# EAGLE design Mikrobus-Cobbler (EAGLE 6.6.0)
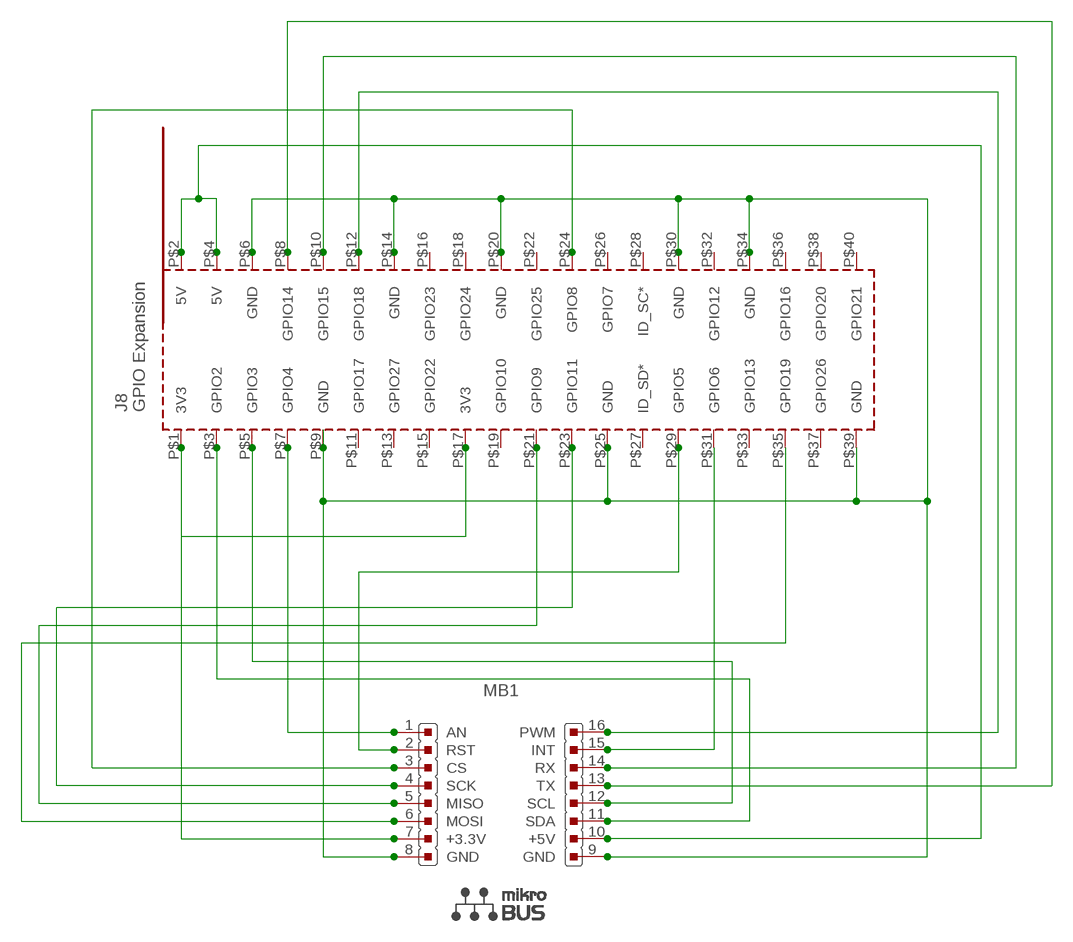
[diagram p0: schematic, sheet 1]

## Parts
MB1  MIKROBUSFOR-COBBLER  [MIKROBUS-COBBLER]
PCB1  RPI2-HEADER  [RPI2-HEADER]

## Nets
+3.3V: MB1.7(+3.3V) PCB1.P$1(3V3) PCB1.P$17(3V3)
+5V: MB1.10(+5V) PCB1.P$2(5V) PCB1.P$4(5V)
AN: MB1.1(AN) PCB1.P$7(GPIO4)
CS: MB1.3(CS) PCB1.P$24(GPIO8)
GND: MB1.8(GND) MB1.9(GND) PCB1.P$6(GND) PCB1.P$9(GND) PCB1.P$14(GND) PCB1.P$20(GND) PCB1.P$25(GND) PCB1.P$30(GND) PCB1.P$34(GND) PCB1.P$39(GND)
INT: MB1.15(INT) PCB1.P$31(GPIO6)
MISO: MB1.5(MISO) PCB1.P$21(GPIO9)
MOSI: MB1.6(MOSI) PCB1.P$35(GPIO19)
PWM: MB1.16(PWM) PCB1.P$12(GPIO18)
RST: MB1.2(RST) PCB1.P$29(GPIO5)
RX: MB1.14(RX) PCB1.P$10(GPIO15)
SCK: MB1.4(SCK) PCB1.P$23(GPIO11)
SCL: MB1.12(SCL) PCB1.P$5(GPIO3)
SDA: MB1.11(SDA) PCB1.P$3(GPIO2)
TX: MB1.13(TX) PCB1.P$8(GPIO14)
Unconnected: PCB1.P$11(GPIO17) PCB1.P$13(GPIO27) PCB1.P$15(GPIO22) PCB1.P$16(GPIO23) PCB1.P$18(GPIO24) PCB1.P$19(GPIO10) PCB1.P$22(GPIO25) PCB1.P$26(GPIO7) PCB1.P$27(ID_SD*) PCB1.P$28(ID_SC*) PCB1.P$32(GPIO12) PCB1.P$33(GPIO13) PCB1.P$36(GPIO16) PCB1.P$37(GPIO26) PCB1.P$38(GPIO20) PCB1.P$40(GPIO21)

## Library data of the parts
MB1 = KS Proto:MIKROBUS: MikroBUS Source: MikroBUS specification <http://www.mikroe.com/downloads/get/1737/mikrobus_specification.pdf> MikroBUS <http://www.mikroe.com/mikrobus/>
PCB1 = KS Proto:RPI2-HEADER: Device for Raspberry Pi 2 board created by www.element14.com More information and support community is available at http://www.element14.com/community/community/raspberry-pi/raspberrypi2

## Board
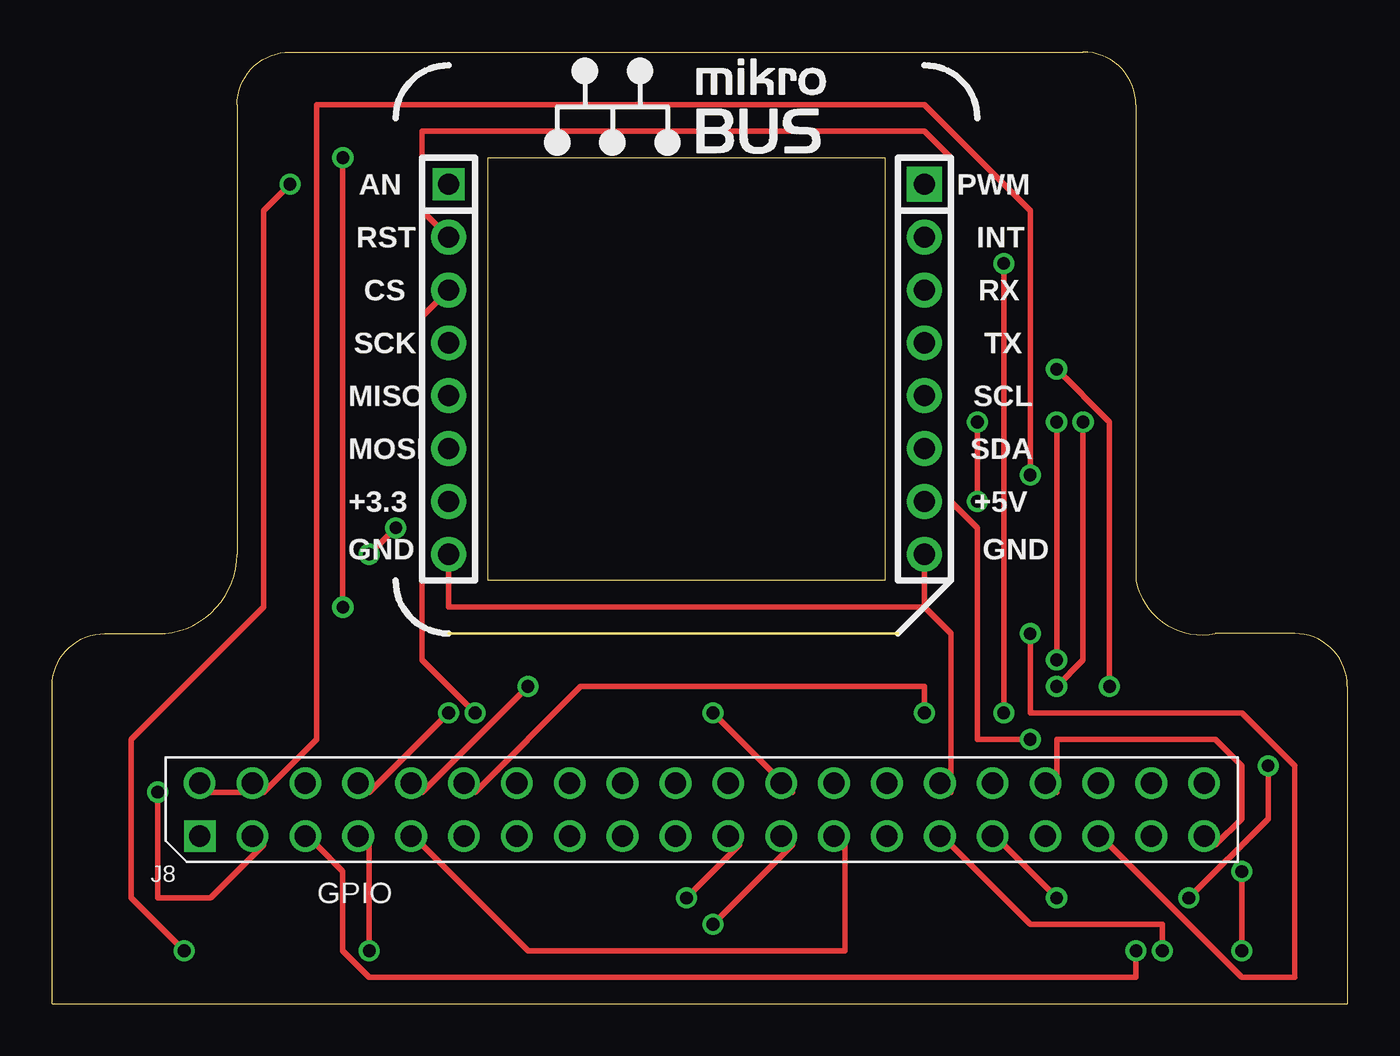
[diagram p1: board, top side]
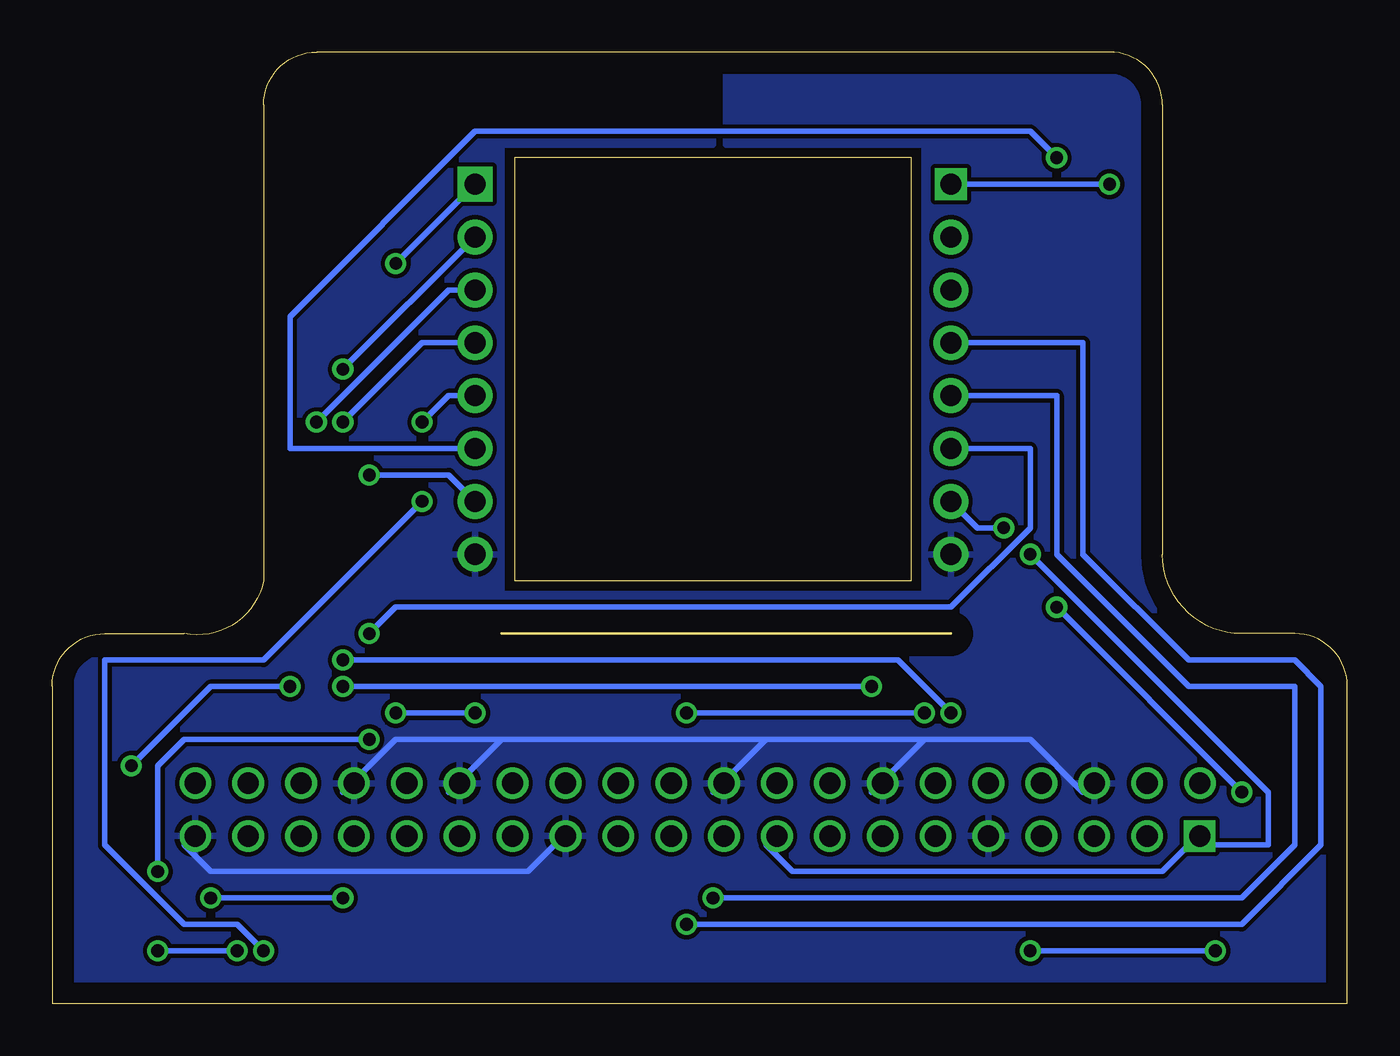
[diagram p2: board, bottom side, seen from below]

Size 62.23 x 45.72 mm. Coordinates in mm from the lower left corner, seen from the top.
Outline: 0,0 62.23,0 62.23,15.24 arc90 59.69,17.78 55.88,17.78 arc-90 52.07,20.32 52.07,43.18 arc90 49.53,45.72 11.43,45.72 arc90 8.89,43.18 8.89,21.59 arc-90 5.08,17.78 2.54,17.78 arc90 0,15.24 0,0
Copper layers (1*16): Top 0.035mm / dielectric 1.5mm / Bottom 0.035mm
Design rules "default": minimum track width 10mil, minimum drill 24mil, track to track 8mil, track to pad 8mil, pad to pad 8mil, via to via 8mil, smd to smd 8mil, copper to edge 40mil, drill to drill 8mil, minimum pad ring 10mil, minimum via ring 8mil, stop-mask expansion 4mil, vias tented up to drill 0mil, thermal gap 10mil
Milling: 4 lines

### Footprints (pad centres in the part's own frame; a part is rotated, then mirrored left to right if it is on the bottom)
MIKROBUS-COBBLER = drill 1.016 square: 1 -11.43,7.62 | drill 1.016 pad 1.676: 2 -11.43,5.08; 3 -11.43,2.54; 4 -11.43,0; 5 -11.43,-2.54; 6 -11.43,-5.08; 7 -11.43,-7.62; 8 -11.43,-10.16; 9 11.43,-10.16; 10 11.43,-7.62; 11 11.43,-5.08; 12 11.43,-2.54; 13 11.43,0; 14 11.43,2.54; 15 11.43,5.08 | drill 1.016 pad 1.676 square: 16 11.43,7.62
RPI2-HEADER = drill 1.016 square: P$1 7.1,4.24 | drill 1.016: P$2 7.087,6.782; P$3 9.627,4.242; P$4 9.627,6.782; P$5 12.167,4.242; P$6 12.167,6.782; P$7 14.707,4.242; P$8 14.707,6.782; P$9 17.247,4.242; P$10 17.247,6.782; P$11 19.787,4.242; P$12 19.787,6.782; P$13 22.327,4.242; P$14 22.327,6.782; P$15 24.867,4.242; P$16 24.867,6.782; P$17 27.407,4.242; P$18 27.407,6.782; P$19 29.947,4.242; P$20 29.947,6.782; P$21 32.487,4.242; P$22 32.487,6.782; P$23 35.027,4.242; P$24 35.027,6.782; P$25 37.567,4.242; P$26 37.567,6.782; P$27 40.107,4.242; P$28 40.107,6.782; P$29 42.647,4.242; P$30 42.647,6.782; P$31 45.187,4.242; P$32 45.187,6.782; P$33 47.727,4.242; P$34 47.727,6.782; P$35 50.267,4.242; P$36 50.267,6.782; P$37 52.807,4.242; P$38 52.807,6.782; P$39 55.347,4.242; P$40 55.347,6.782

### Placement (x,y rotation side)
MB1  30.48,31.75 0 top
PCB1  0,3.81 0 top

### Tracks (layer width: path | path; a pad name or v marks a point on that pad's centre or on a via)
+3.3V  (via drill 0.61)
  Top 0.254: v15.24,21.59 v16.51,22.86
  Bottom 0.254: PCB1.P$17 27.94,7.62 26.67,6.35 8.89,6.35 7.62,7.62 PCB1.P$1 6.35,7.62 3.81,7.62 3.81,10.16 v15.24,21.59 | MB1.7 17.78,22.86 v16.51,22.86
+5V  (via drill 0.61)
  Top 0.254: 10.16,10.16 7.62,10.16 PCB1.P$2 | v46.99,25.4 46.99,38.1 41.91,43.18 12.7,43.18 12.7,12.7 10.16,10.16 | 10.16,10.16 PCB1.P$4
  Bottom 0.254: MB1.10 43.18,25.4 v46.99,25.4
AN  (via drill 0.61)
  Top 0.254: v15.24,2.54 15.24,7.62 PCB1.P$7 | v6.35,2.54 3.81,5.08 3.81,12.7 10.16,19.05 10.16,38.1 v11.43,39.37
  Bottom 0.254: v6.35,2.54 v15.24,2.54 | MB1.1 v11.43,39.37
CS  (via drill 0.61)
  Top 0.254: v31.75,13.97 35.56,10.16 PCB1.P$24 | v20.32,13.97 17.78,16.51 17.78,33.02 MB1.3
  Bottom 0.254: v20.32,13.97 v31.75,13.97
GND
  Top 0.254: PCB1.P$9 17.78,7.62 22.86,2.54 38.1,2.54 38.1,7.62 PCB1.P$25 | MB1.8 19.05,19.05 41.91,19.05 | MB1.9 41.91,19.05 | 41.91,19.05 43.18,17.78 43.18,10.16 PCB1.P$30 | PCB1.P$39 55.88,7.62 57.15,8.89 57.15,11.43 55.88,12.7 48.26,12.7 48.26,10.16 PCB1.P$34
  Bottom 0.254: PCB1.P$39 55.88,7.62 54.61,6.35 39.37,6.35 38.1,7.62 PCB1.P$25 | 20.32,12.7 15.24,12.7 12.7,10.16 PCB1.P$6 | 20.32,12.7 22.86,10.16 PCB1.P$14 | 27.94,12.7 30.48,10.16 PCB1.P$20 | 20.32,12.7 27.94,12.7 | 40.64,12.7 43.18,10.16 PCB1.P$30 | 27.94,12.7 40.64,12.7 | 40.64,12.7 45.72,12.7 48.26,10.16 PCB1.P$34
  pour Bottom (rank 6): 30.48,45.09 48.9,45.09 arc-90 51.44,42.55 51.44,20.32 arc90 54.61,17.14 55.88,17.14 59.69,17.14 arc-90 61.59,15.24 61.59,0.64 0.64,0.64 0.64,15.24 arc-90 2.54,17.14 5.71,17.14 arc90 9.53,20.95 9.53,21.59 9.53,43.18 arc-90 11.43,45.09 29.84,45.09 29.84,41.27 20.32,41.27 20.32,19.68 40.64,19.68 40.64,41.27 30.48,41.27
INT  (via drill 0.61)
  Top 0.254: v48.26,5.08 45.72,7.62 PCB1.P$31 | v54.61,5.08 58.42,8.89 v58.42,11.43 | v50.8,15.24 50.8,27.94 v48.26,30.48
  Bottom 0.254: v54.61,5.08 v48.26,5.08 | v58.42,11.43 54.61,15.24 v50.8,15.24 | MB1.15 v48.26,30.48
MISO  (via drill 0.61)
  Top 0.254: v30.48,5.08 33.02,7.62 PCB1.P$21
  Bottom 0.254: v30.48,5.08 5.08,5.08 2.54,7.62 2.54,15.24 7.62,15.24 13.97,21.59 13.97,29.21 MB1.5
MOSI  (via drill 0.61)
  Top 0.254: v46.99,17.78 46.99,13.97 57.15,13.97 59.69,11.43 59.69,1.27 57.15,1.27 50.8,7.62 PCB1.P$35
  Bottom 0.254: v46.99,17.78 45.72,19.05 19.05,19.05 15.24,22.86 15.24,26.67 MB1.6
PWM  (via drill 0.61)
  Top 0.254: v41.91,13.97 41.91,15.24 25.4,15.24 20.32,10.16 PCB1.P$12 | v45.72,35.56 v45.72,13.97
  Bottom 0.254: v45.72,13.97 v41.91,13.97 | MB1.16 v45.72,35.56
RST  (via drill 0.61)
  Top 0.254: v53.34,2.54 53.34,3.81 46.99,3.81 43.18,7.62 PCB1.P$29 | v57.15,6.35 v57.15,2.54 | v46.99,12.7 44.45,12.7 44.45,22.86 43.18,24.13 43.18,40.64 41.91,41.91 17.78,41.91 17.78,38.1 MB1.2
  Bottom 0.254: v57.15,2.54 v53.34,2.54 | v57.15,6.35 57.15,11.43 55.88,12.7 v46.99,12.7
RX  (via drill 0.61)
  Top 0.254: v22.86,15.24 17.78,10.16 PCB1.P$10 | v48.26,15.24 49.53,16.51 v49.53,27.94
  Bottom 0.254: v48.26,15.24 v22.86,15.24 | v49.53,27.94 43.18,34.29 MB1.14
SCK  (via drill 0.61)
  Top 0.254: v31.75,3.81 35.56,7.62 PCB1.P$23
  Bottom 0.254: v31.75,3.81 5.08,3.81 1.27,7.62 1.27,15.24 2.54,16.51 7.62,16.51 12.7,21.59 12.7,31.75 MB1.4
SCL  (via drill 0.61)
  Top 0.254: v52.07,2.54 52.07,1.27 15.24,1.27 13.97,2.54 13.97,6.35 12.7,7.62 PCB1.P$5 | v44.45,27.94 v44.45,24.13
  Bottom 0.254: v52.07,2.54 53.34,3.81 55.88,3.81 59.69,7.62 59.69,16.51 52.07,16.51 v44.45,24.13 | v44.45,27.94 43.18,29.21 MB1.12
SDA  (via drill 0.61)
  Top 0.254: v5.08,10.16 5.08,5.08 7.62,5.08 10.16,7.62 PCB1.P$3 | v13.97,40.64 v13.97,19.05
  Bottom 0.254: v13.97,19.05 v5.08,10.16 | v13.97,40.64 15.24,41.91 41.91,41.91 50.8,33.02 50.8,26.67 MB1.11
TX  (via drill 0.61)
  Top 0.254: v19.05,13.97 15.24,10.16 PCB1.P$8 | v48.26,27.94 v48.26,16.51
  Bottom 0.254: v19.05,13.97 21.59,16.51 v48.26,16.51 | v48.26,27.94 44.45,31.75 MB1.13